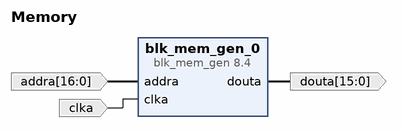
[diagram p0: block diagram of the top level]
# Vivado block design Memory, xc7z010clg400-1, Vivado 2019.1.3
create_bd_design Memory

create_bd_port -dir I -from 16 -to 0 addra
create_bd_port -dir I -type clk clka
set_property -dict {CONFIG.FREQ_HZ 100700000} [get_bd_ports clka]
create_bd_port -dir O -from 15 -to 0 douta

create_bd_cell -type ip -vlnv xilinx.com:ip:blk_mem_gen:8.4 blk_mem_gen_0
set_property -dict [list \
  CONFIG.Coe_File ../../../../../../eagle.coe \
  CONFIG.Enable_32bit_Address false \
  CONFIG.Enable_A Always_Enabled \
  CONFIG.Fill_Remaining_Memory_Locations true \
  CONFIG.Load_Init_File true \
  CONFIG.Memory_Type Single_Port_ROM \
  CONFIG.Port_A_Write_Rate 0 \
  CONFIG.Register_PortA_Output_of_Memory_Primitives true \
  CONFIG.Use_RSTA_Pin false \
  CONFIG.Write_Depth_A 131072 \
  CONFIG.Write_Width_A 16 \
  CONFIG.use_bram_block Stand_Alone \
] [get_bd_cells blk_mem_gen_0]

# ---- connections ----

connect_bd_net [get_bd_ports addra] [get_bd_pins blk_mem_gen_0/addra]
connect_bd_net [get_bd_pins blk_mem_gen_0/douta] [get_bd_ports douta]
connect_bd_net [get_bd_ports clka] [get_bd_pins blk_mem_gen_0/clka]

validate_bd_design
save_bd_design
